# Altium schematic sheet coil_inj_drivers.SchDoc
size A4; SheetNumber: 2; SheetTotal: 8
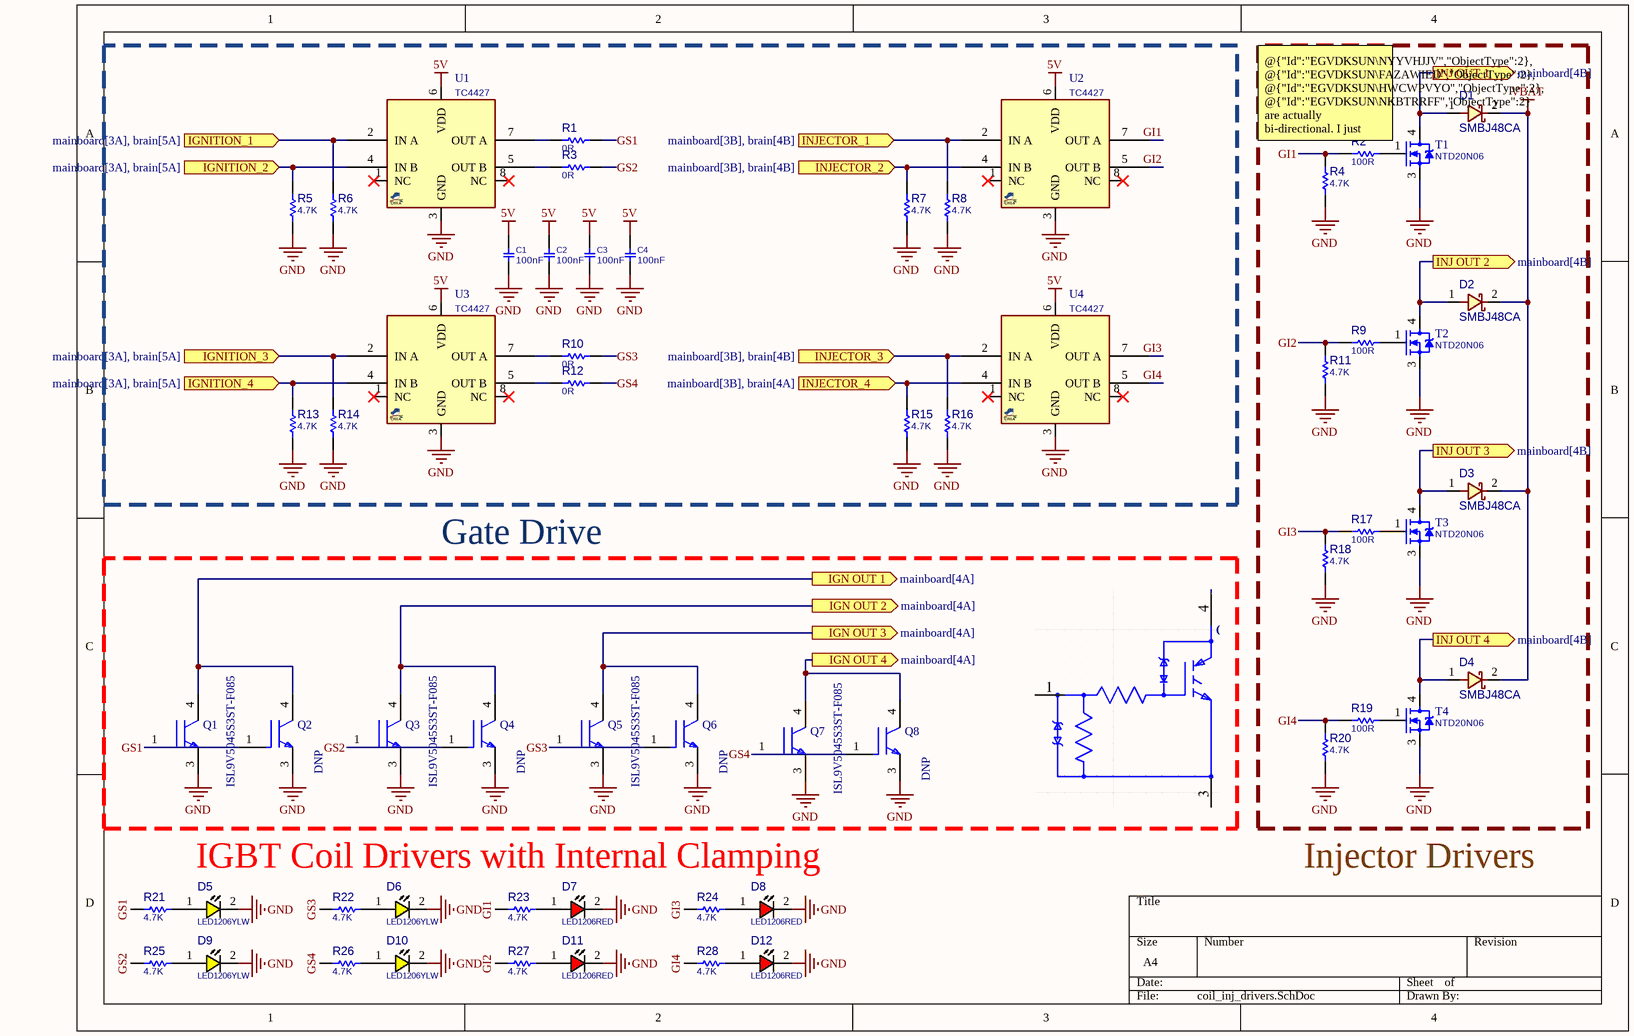
[diagram p0: coil_inj_drivers.SchDoc]

## Parts
C1  100nF  [C1206]
C2  100nF  [C1206]
C3  100nF  [C1206]
C4  100nF  [C1206]
D1  SMBJ48CA  [D_SMB]
D2  SMBJ48CA  [D_SMB]
D3  SMBJ48CA  [D_SMB]
D4  SMBJ48CA  [D_SMB]
D5  LED1206YLW  [LED1206YLW]
D6  LED1206YLW  [LED1206YLW]
D7  LED1206RED  [LED1206RED]
D8  LED1206RED  [LED1206RED]
D9  LED1206YLW  [LED1206YLW]
D10  LED1206YLW  [LED1206YLW]
D11  LED1206RED  [LED1206RED]
D12  LED1206RED  [LED1206RED]
Q1  ISL9V5045S3ST-F085  [FP-418AJ-MFG]
Q2  DNP  [FP-369AS-MFG]
Q3  ISL9V5045S3ST-F085  [FP-418AJ-MFG]
Q4  DNP  [FP-369AS-MFG]
Q5  ISL9V5045S3ST-F085  [FP-418AJ-MFG]
Q6  DNP  [FP-369AS-MFG]
Q7  ISL9V5045S3ST-F085  [FP-418AJ-MFG]
Q8  DNP  [FP-369AS-MFG]
R1  0R  [R0805]
R2  100R  [R0805]
R3  0R  [R0805]
R4  4.7K  [R0805]
R5  4.7K  [R0805]
R6  4.7K  [R0805]
R7  4.7K  [R0805]
R8  4.7K  [R0805]
R9  100R  [R0805]
R10  0R  [R0805]
R11  4.7K  [R0805]
R12  0R  [R0805]
R13  4.7K  [R0805]
R14  4.7K  [R0805]
R15  4.7K  [R0805]
R16  4.7K  [R0805]
R17  100R  [R0805]
R18  4.7K  [R0805]
R19  100R  [R0805]
R20  4.7K  [R0805]
R21  4.7K  [R0805]
R22  4.7K  [R0805]
R23  4.7K  [R0805]
R24  4.7K  [R0805]
R25  4.7K  [R0805]
R26  4.7K  [R0805]
R27  4.7K  [R0805]
R28  4.7K  [R0805]
T1  NTD20N06  [DPAK_3]
T2  NTD20N06  [DPAK_3]
T3  NTD20N06  [DPAK_3]
T4  NTD20N06  [DPAK_3]
U1  TC4427  [SO_8]
U2  TC4427  [SO_8]
U3  TC4427  [SO_8]
U4  TC4427  [SO_8]

## Ports
IGN OUT 1 (out, see mainboard[4A]), IGN OUT 2 (out, see mainboard[4A]), IGN OUT 3 (out, see mainboard[4A]), IGN OUT 4 (out, see mainboard[4A]), IGNITION_1 (in, see mainboard[3A], brain[5A]), IGNITION_2 (in, see mainboard[3A], brain[5A]), IGNITION_3 (in, see mainboard[3A], brain[5A]), IGNITION_4 (in, see mainboard[3A], brain[5A]), INJ OUT 1 (out, see mainboard[4B]), INJ OUT 2 (out, see mainboard[4B]), INJ OUT 3 (out, see mainboard[4B]), INJ OUT 4 (out, see mainboard[4B]), INJECTOR_1 (in, see mainboard[3B], brain[4B]), INJECTOR_2 (in, see mainboard[3B], brain[4B]), INJECTOR_3 (in, see mainboard[3B], brain[4B]), INJECTOR_4 (in, see mainboard[3B], brain[4A])

## Nets
5V: C1.2 C2.2 C3.2 C4.2 U1.6(VDD) U2.6(VDD) U3.6(VDD) U4.6(VDD)
GND: C1.1 C2.1 C3.1 C4.1 D5.2(CATHODE) D6.2(CATHODE) D7.2(CATHODE) D8.2(CATHODE) D9.2(CATHODE) D10.2(CATHODE) D11.2(CATHODE) D12.2(CATHODE) Q1.3(E) Q2.3(E) Q3.3(E) Q4.3(E) Q5.3(E) Q6.3(E) Q7.3(E) Q8.3(E) R4.1 R5.1 R6.1 R7.1 R8.1 R11.1 R13.1 R14.1 R15.1 R16.1 R18.1 R20.1 T1.3(S) T2.3(S) T3.3(S) T4.3(S) U1.3(GND) U2.3(GND) U3.3(GND) U4.3(GND)
VBAT: D1.2 D2.2 D3.2 D4.2
GI1: R2.2 R4.2 R23.2 U2.7(OUT_A)
GI2: R9.2 R11.2 R27.2 U2.5(OUT_B)
GI3: R17.2 R18.2 R24.2 U4.7(OUT_A)
GI4: R19.2 R20.2 R28.2 U4.5(OUT_B)
GS1: Q1.1(GATE) Q2.1(GATE) R1.1 R21.2
GS2: Q3.1(GATE) Q4.1(GATE) R3.1 R25.2
GS3: Q5.1(GATE) Q6.1(GATE) R10.1 R22.2
GS4: Q7.1(GATE) Q8.1(GATE) R12.1 R26.2
IGN OUT 1: Q1.4(C) Q2.4(C) ; port IGN OUT 1
IGN OUT 2: Q3.4(C) Q4.4(C) ; port IGN OUT 2
IGN OUT 3: Q5.4(C) Q6.4(C) ; port IGN OUT 3
IGN OUT 4: Q7.4(C) Q8.4(C) ; port IGN OUT 4
IGNITION_1: R6.2 U1.2(IN_A) ; port IGNITION_1
IGNITION_2: R5.2 U1.4(IN_B) ; port IGNITION_2
IGNITION_3: R14.2 U3.2(IN_A) ; port IGNITION_3
IGNITION_4: R13.2 U3.4(IN_B) ; port IGNITION_4
INJ OUT 1: D1.1 T1.4(D) ; port INJ OUT 1
INJ OUT 2: D2.1 T2.4(D) ; port INJ OUT 2
INJ OUT 3: D3.1 T3.4(D) ; port INJ OUT 3
INJ OUT 4: D4.1 T4.4(D) ; port INJ OUT 4
INJECTOR_1: R8.2 U2.2(IN_A) ; port INJECTOR_1
INJECTOR_2: R7.2 U2.4(IN_B) ; port INJECTOR_2
INJECTOR_3: R16.2 U4.2(IN_A) ; port INJECTOR_3
INJECTOR_4: R15.2 U4.4(IN_B) ; port INJECTOR_4
NetD5_1: D5.1(ANODE) R21.1
NetD6_1: D6.1(ANODE) R22.1
NetD7_1: D7.1(ANODE) R23.1
NetD8_1: D8.1(ANODE) R24.1
NetD9_1: D9.1(ANODE) R25.1
NetD10_1: D10.1(ANODE) R26.1
NetD11_1: D11.1(ANODE) R27.1
NetD12_1: D12.1(ANODE) R28.1
NetR1_2: R1.2 U1.7(OUT_A)
NetR2_1: R2.1 T1.1(G)
NetR3_2: R3.2 U1.5(OUT_B)
NetR9_1: R9.1 T2.1(G)
NetR10_2: R10.2 U3.7(OUT_A)
NetR12_2: R12.2 U3.5(OUT_B)
NetR17_1: R17.1 T3.1(G)
NetR19_1: R19.1 T4.1(G)

Not connected (* = marked no-connect by the designer): U1 1(NC)* 8(NC)*; U2 1(NC)* 8(NC)*; U3 1(NC)* 8(NC)*; U4 1(NC)* 8(NC)*

## Notes on the sheet
- @{"Id":"EGVDKSUN\NYYVHJJV","ObjectType":2}, @{"Id":"EGVDKSUN\FAZAWIED","ObjectType":2}, @{"Id":"EGVDKSUN\HWCWPVYO","ObjectType":2}, @{"Id":"EGVDKSUN\NKBTRRFF","ObjectType":2} are actually bi-directional. I just didn't have the symbol :(   The footprint is correct though :)
- Gate Drive
- IGBT Coil Drivers with Internal Clamping
- Injector Drivers

## Library data of the parts
C1-C4 = CAP_SMD_MLCC: CAP, MLCC; PARAM: C0G, 10%; DESC: CAP, MLCC, 1nF, 50V, C0G, 10%, 0402; MANF_P#: MANF_PART#; MANF: Murata; PARAM2: 50V; PRICE: 100= 1$; ASSEMBLY: ASSEMBLY; VALUE: 100nF
D1-D4 = DIODE_SMD_SCHOTTKY_SS34: DIODE, SCHOTTKY, 20V, 3A; MANF: VISHAY; MANF_P#: SS34; DESC: DESCRIPTION; ASSEMBLY: ASSEMBLY; PRICE: PRICE; PARAM2: 3A; PARAM: 20V; VALUE: SMBJ48CA
D5 D6 D9 D10 = LED_SMD_1206_YLW: LED, SMD, 1206, YELLOW; DESC: DESCRIPTION; MANF_P#: MANF_PART#; PARAM2: 2.2V; MANF: MANF; ASSEMBLY: ASSEMBLY; PRICE: 36t@Javan; VALUE: LED1206YLW
D7 D8 D11 D12 = LED_SMD_1206_RED: LED, SMD, 1206, RED; DESC: DESCRIPTION; MANF_P#: MANF_PART#; PARAM2: 2.2V; MANF: MANF; ASSEMBLY: ASSEMBLY; PRICE: 36t@Javan; VALUE: LED1206RED
Q1 Q3 Q5 Q7 = CMP-00278-87655068-1: ISL9V5045S3ST-F085 Trans IGBT Chip N-CH 445V 51A 300000mW Automotive 3-Pin(2+Tab) D2PAK T/R; Element Configuration: Single; Clamping Voltage: 450V; Collector Emitter Breakdown Voltage: 480V; Collector Emitter Saturation Voltage: 1.25V; Turn-Off Delay Time: 10.8µs; Turn-On Delay Time: 700ns; Power Dissipation: 300W; Max Junction Temperature (Tj): 175°C; Collector Emitter Voltage (VCEO): 1.6V; RoHS: Compliant; Max Collector Current: 51A; Schedule B: 8541290080, 8541290080; Mount: Surface Mount; Max Operating Temperature: 175°C; Min Operating Temperature: -40°C; Number of Pins: 3; NexarPartId: 87655068; Max Breakdown Voltage: 480V; Lead Free: Lead Free; Max Power Dissipation: 300W; Continuous Collector Current: 51A; Height: 5.08mm; Case/Package: TO-263-3; Weight: 1.31247g
Q2 Q4 Q6 Q8 = IGNITION IGBT: NexarPartId: 87655026; Collector Emitter Saturation Voltage: 1.15V; Collector Emitter Voltage (VCEO): 1.5V; Max Collector Current: 41A; Element Configuration: Single; Max Breakdown Voltage: 400V; Max Power Dissipation: 150W; Radiation Hardening: No; RoHS: Compliant; Schedule B: 8541290080, 8541290080|8541290080, 8541290080|8541290080|8541290080, 8541290080|8541290080|8541290080|8541290080; Number of Pins: 3; Max Operating Temperature: 175°C; Mount: Surface Mount; Case/Package: DPAK; Min Operating Temperature: -55°C; Clamping Voltage: 400V; Weight: 260.37mg; Collector Emitter Breakdown Voltage: 400V
R1-R28 = RES_SMD_0805: RESISTOR, SMD; PARAM: -W; DESC: DESCRIPTION; DIST#: MOUSER; PARAM2: 1%; MANF_P#: -; MANF: -; ASSEMBLY: ASSEMBLY; PRICE: 100= 0.5$
  R1 R3 R10 R12: VALUE: 0R
  R2 R9 R17 R19: VALUE: 100R
  R4-R8 R11 R13-R16 R18 R20-R28: VALUE: 4.7K
T1-T4 = MOSN_NTD20N06_DPAK: MOSFET, N-CH, 60V, 20A, 39mRDS, 1~2VGSth; MANF_P#: NTD20N06L; PARAM2: 60VDS, 1~2VGSth; PARAM: 20A, 39mRDS, Cin700pF, -55~150oC; MANF: ON; ASSEMBLY: ASSEMBLY; PRICE: 0.9$; VALUE: NTD20N06
U1-U4 = MOS_DUAL_TC4427: power Mosfet Driver, Dual, High-Speed, 1.5A; ASSEMBLY: ASSEMBLY; MANF_P#: TC4427; VALUE: TC4427